# EAGLE design ATtiny_4585_dev_board_with_power_reg_and_resonator (EAGLE 6.2)
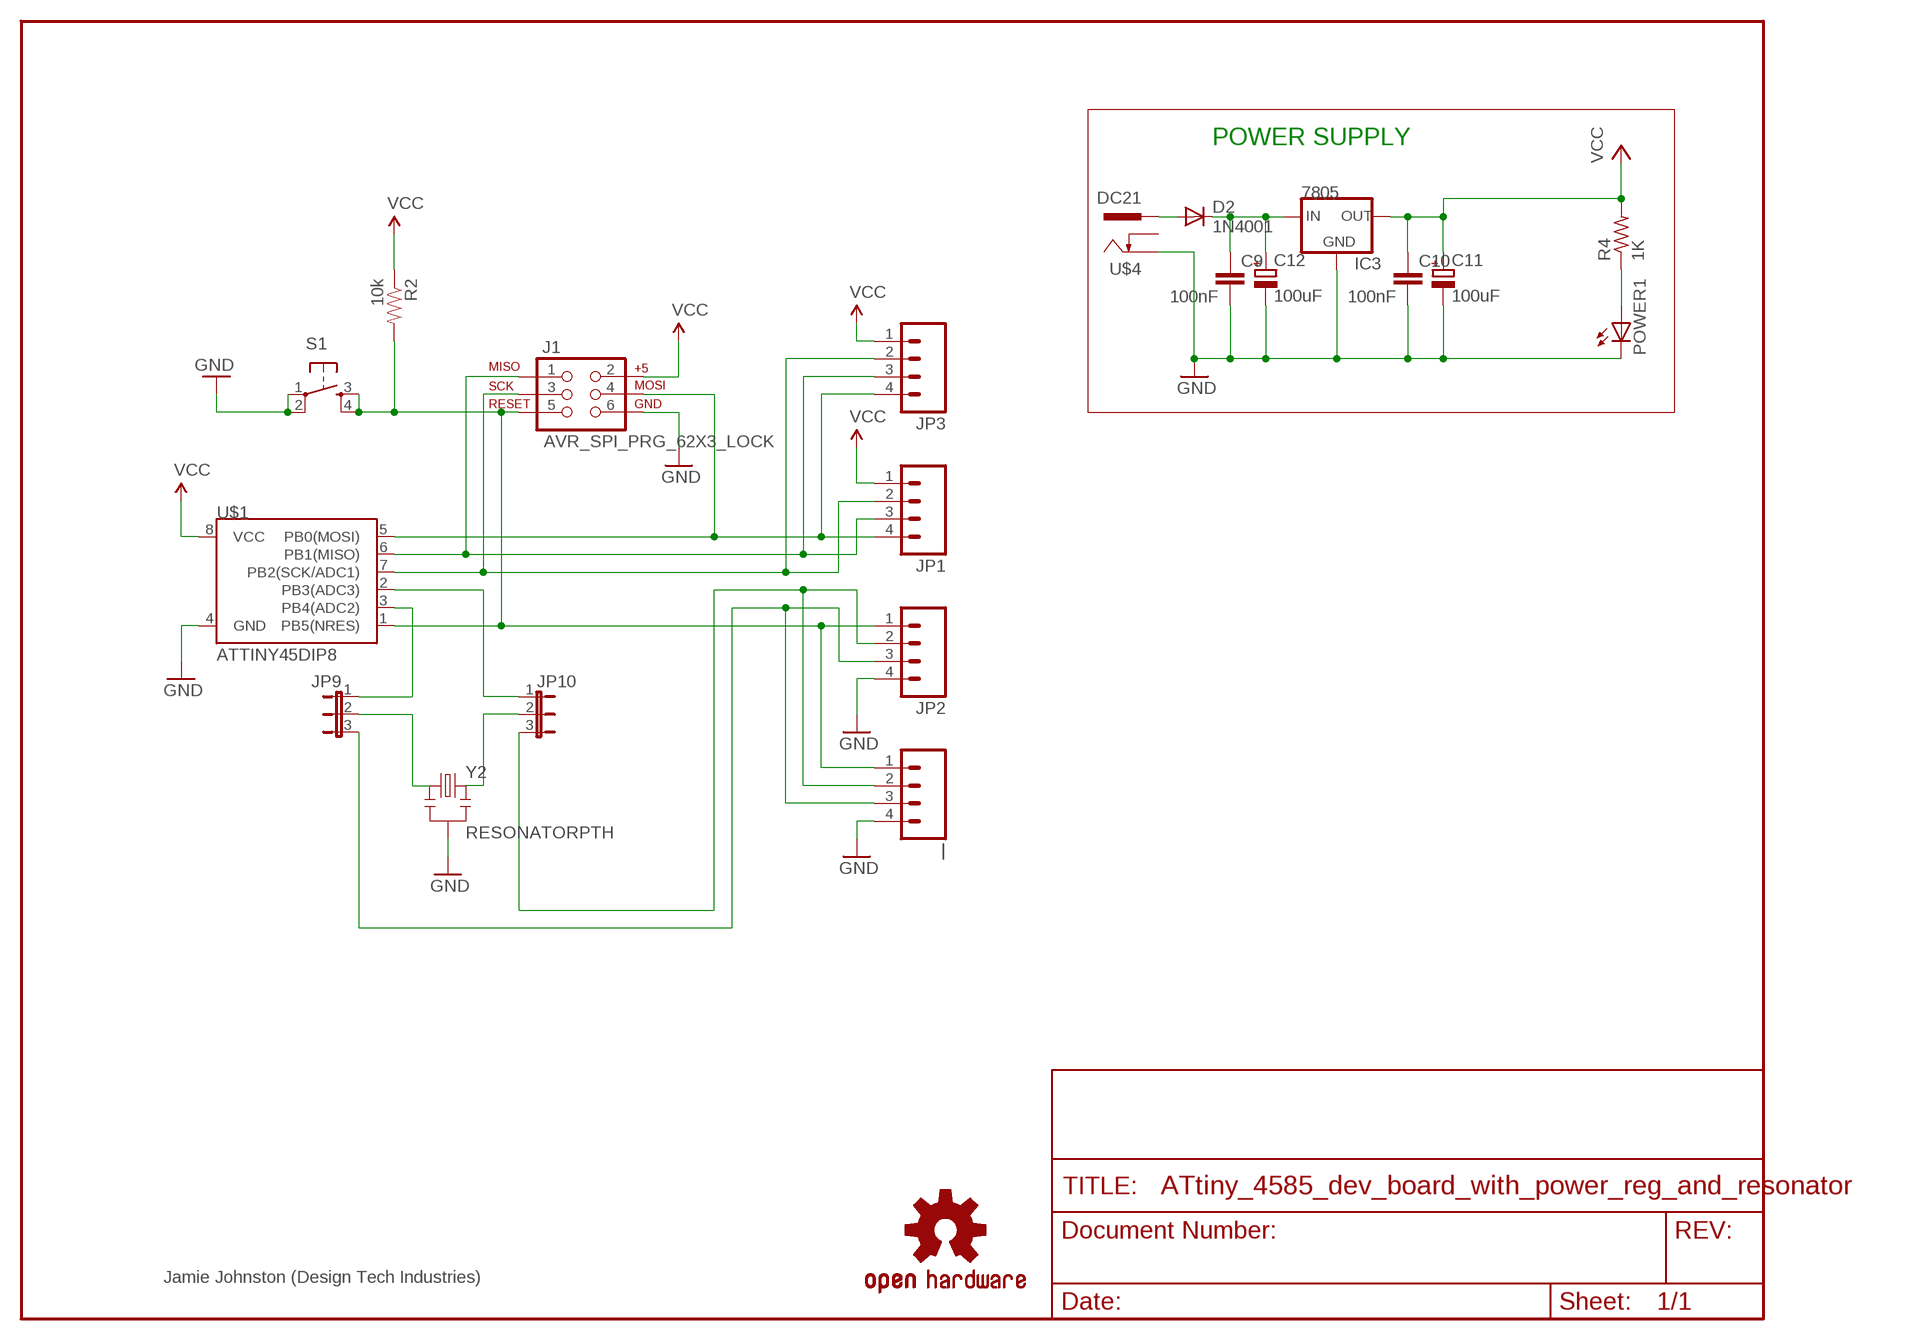
[diagram p0: schematic, sheet 1]

## Parts
C9  100nF  C-EU050-030X075  [C050-030X075]
C10  100nF  C-EU050-030X075  [C050-030X075]
C11  100uF  CPOL-EUE2.5-6  [E2,5-6]
C12  100uF  CPOL-EUE2.5-6  [E2,5-6]
D2  1N4001  1N4004  [DO41-10]
IC3  7805  V_REG_78XXSINK  [TO220-IGO]
J1  AVR_SPI_PRG_62X3_LOCK  [2X3_LOCK]
JP1  M04LOCK  [1X04_LOCK]
JP2  M04LOCK  [1X04_LOCK]
JP3  M04LOCK  [1X04_LOCK]
JP9  JP2E  [JP2]
JP10  JP2E  [JP2]
POWER1  LED3MM  [LED3MM]
R2  10k  RESISTORPTH-1/4W  [AXIAL-0.4]
R4  1K  R-US_0207/2V  [0207/2V]
S1  TAC_SWITCHPTH  [TACTILE-PTH]
U$1  ATTINY45DIP8  [DIP08]
U$3  OSHW-LOGOM  [OSHW-LOGO-M]
U$4  DC21  [DCSKT]
Y2  RESONATORPTH  [RESONATOR-PTH]
|  M04LOCK  [1X04_LOCK]

## Nets
GND: C9.2 C10.2 C11.- C12.- IC3.GND J1.6 JP2.4 POWER1.K(C) S1.1 S1.2 U$1.4(GND) U$4.2 Y2.2 |.4
N$1: JP9.1 U$1.3(PB4(ADC2))
N$2: J1.4 JP1.4 JP3.4 U$1.5(PB0(MOSI))
N$3: J1.5 JP2.1 R2.P$2 S1.3 S1.4 U$1.1(PB5(NRES)) |.1
N$4: JP10.1 U$1.2(PB3(ADC3))
N$6: J1.1 JP1.3 JP3.3 U$1.6(PB1(MISO))
N$7: J1.3 JP1.2 JP3.2 U$1.7(PB2(SCK/ADC1))
N$9: JP2.2 JP10.3 |.2
N$10: JP2.3 JP9.3 |.3
N$14: POWER1.A R4.1
N$20: JP9.2 Y2.1
N$21: JP10.2 Y2.3
VCC: C10.1 C11.+ IC3.OUT J1.2 JP1.1 JP3.1 R2.P$1 R4.2 U$1.8(VCC)
VIN [power]: D2.A U$4.1
VIN_SAFE [power]: C9.1 C12.+ D2.C IC3.IN
Unconnected: U$4.3

## Notes on the sheet
- POWER SUPPLY
- Jamie Johnston (Design Tech Industries)

## Library data of the parts
C9 C10 = rcl:C-EU: CAPACITOR, European symbol
C11 C12 = rcl:CPOL-EU: POLARIZED CAPACITOR, European symbol
D2 = diode:1N4004: DIODE general purpose rectifier, 1 A
IC3 = SparkFun:V_REG_78XX: Voltage Regulator Standard 7805 5V regulator. IGO (Input Ground Output). Spark Fun Electronics SKU : COM-00107
J1 = SparkFun:AVR_SPI_PRG_6: AVR ISP 6 Pin This is the reduced ISP connector for AVR programming. Common on Arduino. This footprint will take up less PCB space and can be used with a 10-pin to 6-pin adapter such as SKU: BOB-08508
JP1-JP3 | = SparkFun:M04: Header 4 Standard 4-pin 0.1" header. Use with straight break away headers (SKU : PRT-00116), right angle break away headers (PRT-00553), swiss pins (PRT-00743), machine pins (PRT-00117), and female headers (PRT-00115). Molex polarized connector foot print use with SKU : PRT-08231 with associated crimp pins and housings. 1MM SMD Version SKU: PRT-10208
JP9 JP10 = jumper:JP2E: JUMPER
POWER1 = led:LED: LED OSRAM: - CHIPLED LG R971, LG N971, LY N971, LG Q971, LY Q971, LO R971, LY R971 LH N974, LH R974 LS Q976, LO Q976, LY Q976 LO Q996 - Hyper CHIPLED LW Q18S LB Q993, LB Q99A, LB R99A - SideLED LS A670, LO A670, LY A670, LG A670, LP A670 LB A673, LV A673, LT A673, LW A673 LH A674 LY A675 LS A676, LA A676, LO A676, LY A676, LW A676 LS A679, LY A679, LG A679 - Hyper Micro SIDELED® LS Y876, LA Y876, LO Y876, LY Y876 LT Y87S - SmartLED LW L88C, LW L88S LB L89C, LB L89S, LG L890 LS L89K, LO L89K, LY L89K LS L896, LA L896, LO L896, LY L896 - TOPLED LS T670, LO T670, LY T670, LG T670, LP T670 LSG T670, LSP T670, LSY T670, LOP T670, LYG T670 LG T671, LOG T671, LSG T671 LB T673, LV T673, LT T673, LW T673 LH T674 LS T676, LA T676, LO T676, LY T676, LB T676, LH T676, LSB T676, LW T676 LB T67C, LV T67C, LT T67C, LS T67K, LO T67K, LY T67K, LW E67C LS E67B, LA E67B, LO E67B, LY E67B, LB E67C, LV E67C, LT E67C LW T67C LS T679, LY T679, LG T679 LS T770, LO T770, LY T770, LG T770, LP T770 LB T773, LV T773, LT T773, LW T773 LH T774 LS E675, LA E675, LY E675, LS T675 LS T776, LA T776, LO T776, LY T776, LB T776 LHGB T686 LT T68C, LB T68C - Hyper Mini TOPLED® LB M676 - Mini TOPLED Santana® LG M470 LS M47K, LO M47K, LY M47K Source: http://www.osram.convergy.de - LUMILED® LXK2-PW12-R00, LXK2-PW12-S00, LXK2-PW14-U00, LXK2-PW14-V00 LXK2-PM12-R00, LXK2-PM12-S00, LXK2-PM14-U00 LXK2-PE12-Q00, LXK2-PE12-R00, LXK2-PE12-S00, LXK2-PE14-T00, LXK2-PE14-U00 LXK2-PB12-K00, LXK2-PB12-L00, LXK2-PB12-M00, LXK2-PB14-N00, LXK2-PB14-P00, LXK2-PB14-Q00 LXK2-PR12-L00, LXK2-PR12-M00, LXK2-PR14-Q00, LXK2-PR14-R00 LXK2-PD12-Q00, LXK2-PD12-R00, LXK2-PD12-S00 LXK2-PH12-R00, LXK2-PH12-S00 LXK2-PL12-P00, LXK2-PL12-Q00, LXK2-PL12-R00 Source: www.luxeon.com
R2 = SparkFun:RESISTOR: Resistor Basic schematic elements and footprints for 0603, 1206, and PTH resistors.
R4 = rcl:R-US_: RESISTOR, American symbol
S1 = SparkFun:TAC_SWITCH: Momentary Switch Button commonly used for reset or general input. Spark Fun Electronics SKU : COM-00097
U$1 = SparkFun:ATTINY45: Atmel ATTiny45
U$3 = SparkFun-Aesthetics:OSHW-LOGO: Open Source Hardware Logo This logo indicates the piece of hardware it is found on incorporates a OSHW license and/or adheres to the definition of open source hardware found here: http://freedomdefined.org/OSHW
U$4 = dcsocket:DC21: DC 2.1 mm Power Socket Negative Centre
Y2 = SparkFun-FreqCtrl:RESONATOR: Resonator Small SMD resonator. This is the itty bitty 10/20MHz resonators with built in caps. CSTCE10M0G55 and CSTCE20M0V53. Footprint has been reviewed closely but hasn't been tested yet.

## Net classes
1 power: width 0.635 mm, clearance 0.406 mm

## Board
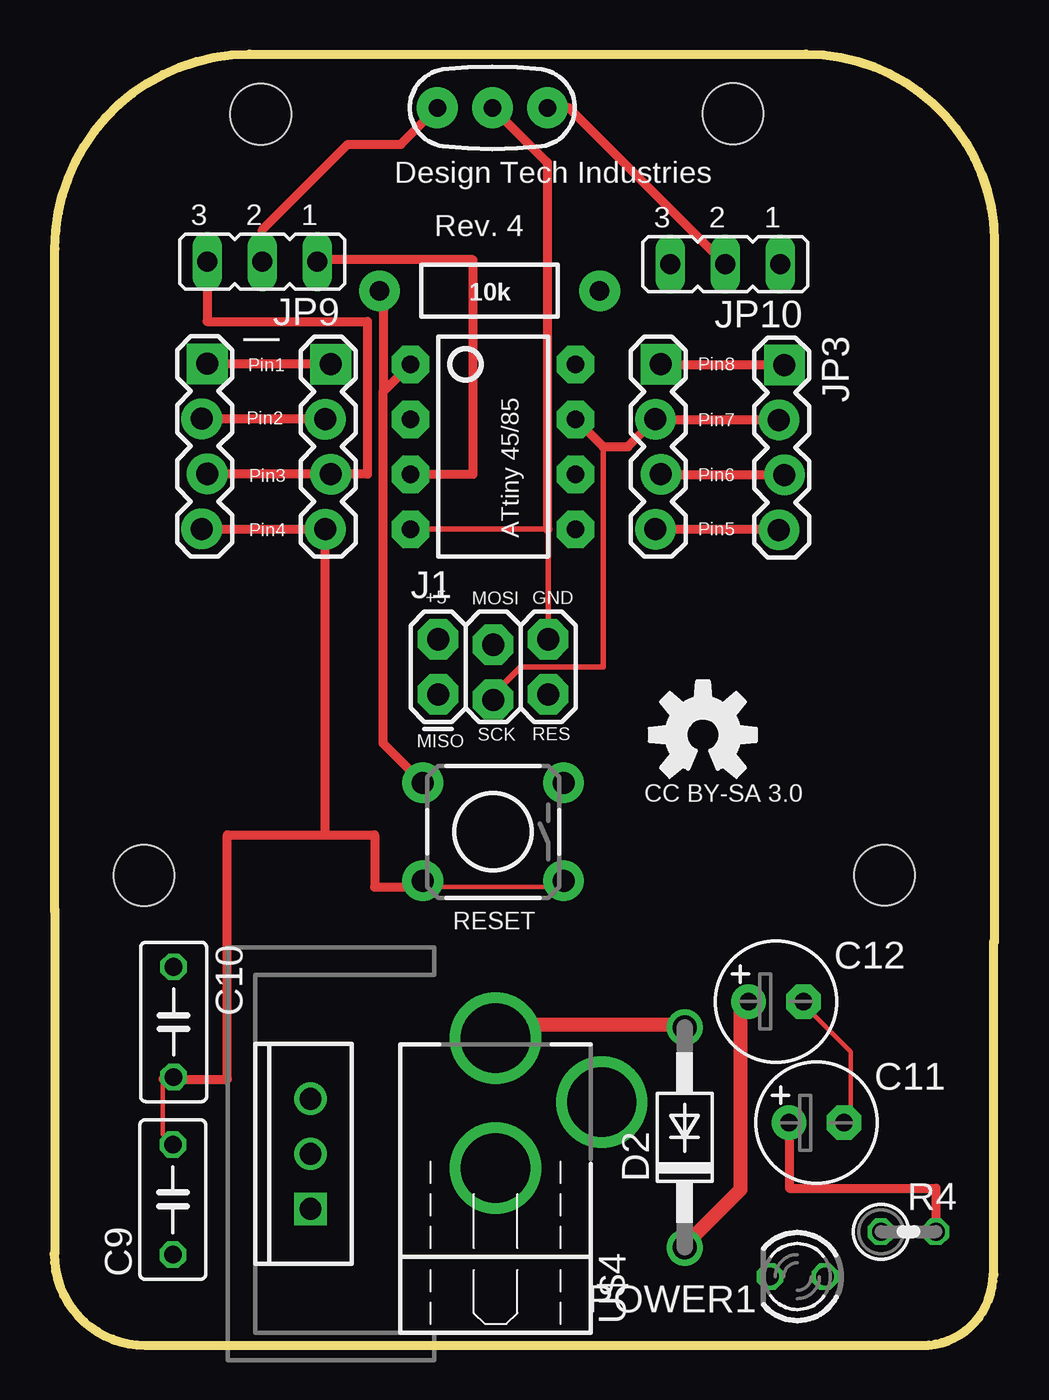
[diagram p1: board, top side]
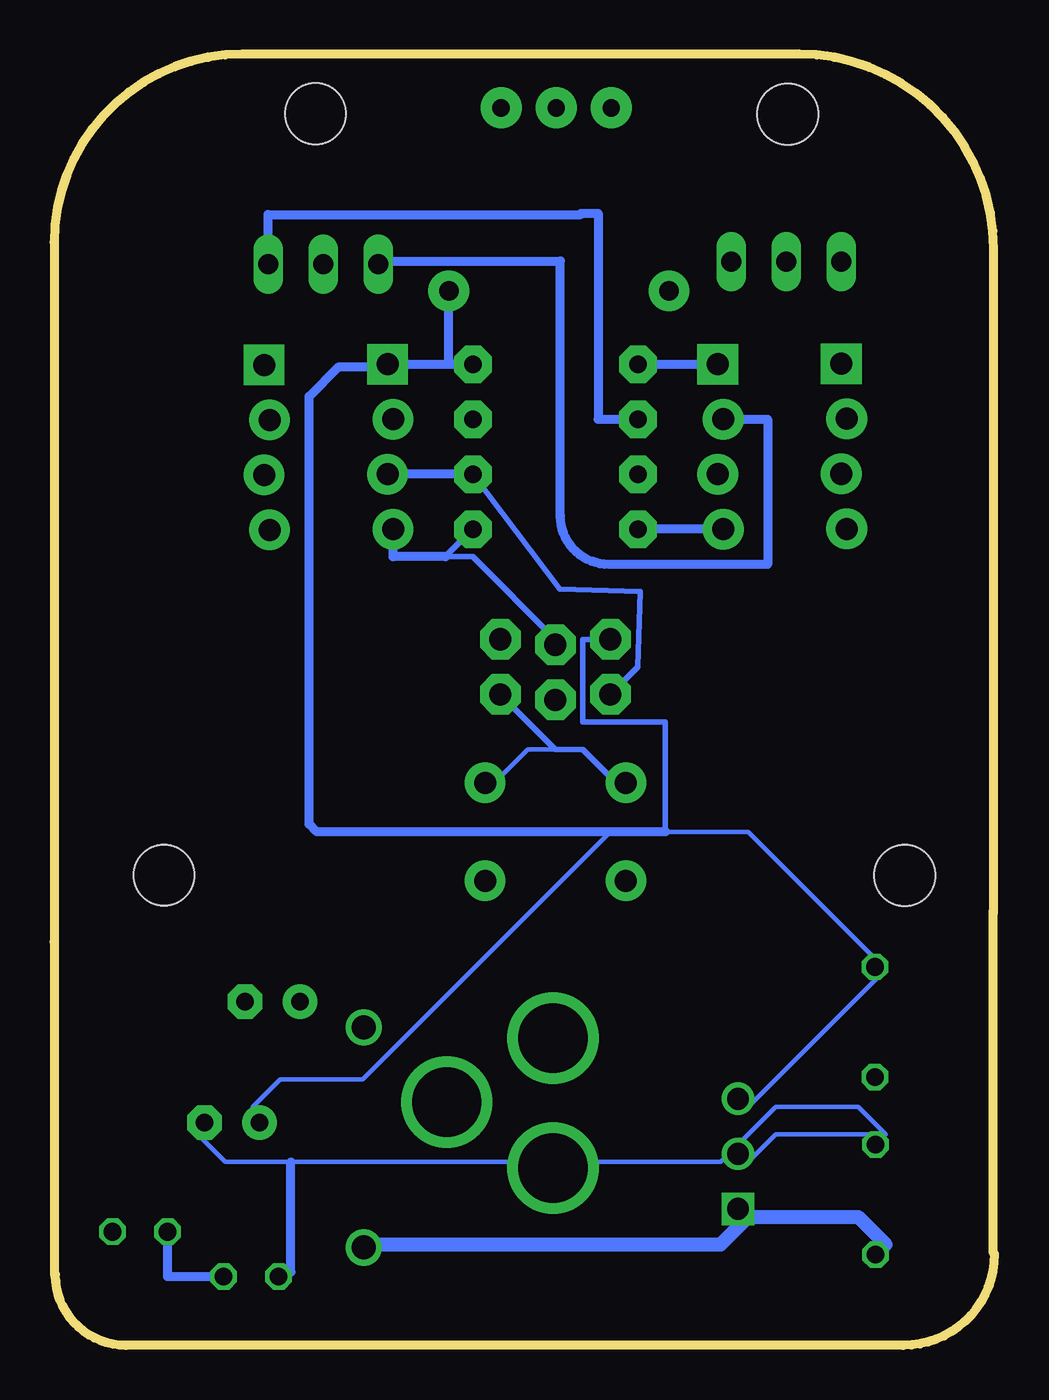
[diagram p2: board, bottom side, seen from below]

Size 43.4 x 59.62 mm. Coordinates in mm from the lower left corner, seen from the top.
Outline: 0,4.21 arc90 4.21,0 40.08,0 arc90 43.34,3.26
Outline: 0.05,4.25 0.05,20.11
Outline: 43.38,3.26 43.38,18.68
Outline: 0.04,19.99 0.04,50.64 arc-90 9.02,59.62 34.7,59.62 arc-90 43.4,50.92 43.4,18.63
Copper layers (1*16): Top 0.0356mm / dielectric 1.5011mm / Bottom 0.0356mm
Design rules: minimum track width 6mil, minimum drill 13mil, track to track 6mil, track to pad 6mil, pad to pad 6mil, via to via 6mil, smd to smd 6mil, copper to edge 15mil, drill to drill 6mil, minimum pad ring 7mil, minimum via ring 7mil, stop-mask expansion 4mil, vias tented up to drill 0mil, thermal gap 10mil
Holes 2.8 mm at 4.14,21.7 38.33,21.71 9.54,56.85 31.34,56.87

### Footprints (pad centres in the part's own frame; a part is rotated, then mirrored left to right if it is on the bottom)
C050-030X075 = drill 0.813 octagon: 1 -2.54,0; 2 2.54,0
E2,5-6 = drill 0.813 pad 1.6: + -1.27,0 | drill 0.813 pad 1.6 octagon: - 1.27,0
DO41-10 = drill 1.118: A 5.08,0; C -5.08,0
TO220-IGO = drill 1: GND 0,0; OUT 2.54,0 | drill 1 square: IN -2.54,0
2X3_LOCK = drill 1.016 pad 1.88 octagon: 1 0,0; 2 0,2.54; 3 2.54,-0.254; 4 2.54,2.286; 5 5.08,0; 6 5.08,2.54
1X04_LOCK = drill 1.016 pad 1.88 square: 1 0,0.127 | drill 1.016 pad 1.88: 2 2.54,-0.127; 3 5.08,0.127; 4 7.62,-0.127
JP2 = drill 0.914 long: 1 -2.54,0; 2 0,0; 3 2.54,0
LED3MM = drill 0.813 octagon: A -1.27,0; K 1.27,0
AXIAL-0.4 = drill 0.9 pad 1.88: P$1 -5.08,0; P$2 5.08,0
0207/2V = drill 0.813 octagon: 1 -1.27,0; 2 1.27,0
TACTILE-PTH = drill 1.016 pad 1.88: 1 -3.251,2.261; 2 3.251,2.261; 3 -3.251,-2.261; 4 3.251,-2.261
DIP08 = drill 0.813 pad 1.727 octagon: 1 -3.81,-3.81; 2 -1.27,-3.81; 3 1.27,-3.81; 4 3.81,-3.81; 5 3.81,3.81; 6 1.27,3.81; 7 -1.27,3.81; 8 -3.81,3.81
DCSKT = drill 3.2: 1 0,6.08; 2 0,0.08; 3 4.9,3.13
RESONATOR-PTH = drill 0.8 pad 1.88: 1 -2.54,0; 2 0,0; 3 2.54,0

### Placement (x,y rotation side)
C9  5.48,6.73 90 top
C10  5.51,14.93 270 top
C11  35.18,10.28 0 top
C12  33.32,15.88 0 top
D2  29.11,9.6 90 top
IC3  11.83,8.84 90 top
J1  17.72,30.06 0 top
JP1  27.88,45.3 270 top
JP2  12.64,45.3 270 top
JP3  33.58,45.27 270 top
JP9  9.61,50.04 180 top
JP10  30.98,49.93 180 top
POWER1  34.31,3.18 180 top
R2  20.1,48.7 180 top
R4  39.43,5.25 0 top
S1  20.26,23.71 180 top
U$1  20.26,41.49 270 top
U$3  29.95,28.19 0 top
U$4  20.38,8.11 0 top
Y2  20.23,57.15 0 top
|  6.94,45.32 270 top

### Tracks (layer width: path | path; a pad name or v marks a point on that pad's centre or on a via)
GND
  Top 0.203: S1.1 22.8,21.17 17.72,21.17 17.46,21.28 S1.2 16.45,21.17 | C9.2 5.02,9.74 5.02,12.28 C10.2 | C12.- 34.23,16.09 36.77,13.55 36.77,11.01 C11.-
  Top 0.254: J1.6 22.8,37.68 U$1.4
  Top 0.406: 5.02,12.28 7.99,12.28 7.99,23.57 12.51,23.57 | 12.51,23.57 JP2.4 12.51,37.7 |.4 | 12.51,23.57 14.79,23.57 14.79,21.17 17.46,21.17 17.46,21.28 | 22.8,37.68 22.78,37.68 22.78,54.61 22.76,54.61 Y2.2
  Bottom 0.203: C11.- 36.77,9.74 35.5,8.47 32.48,8.47 21.53,8.47 U$4.2 20.26,8.47 12.64,8.47 10.1,11.01 6.29,11.01 5.02,9.74 | 5.02,9.74 10.1,9.74 11.37,8.47 IC3.GND | 32.96,3.39 POWER1.K | 5.02,9.74 C9.2
  Bottom 0.406: JP2.4 U$1.4 | 32.96,3.39 32.48,3.39 32.48,8.47
N$1
  Top 0.406: U$1.3 19.34,40.22 19.34,50.12 12.15,50.12 JP9.1
N$2
  Top 0.406: JP1.4 33.46,37.68 JP3.4
  Bottom 0.254: U$1.5 25.34,36.41 24.07,36.41 20.26,32.6 J1.4
  Bottom 0.406: 25.34,36.41 27.75,36.41 JP1.4
N$3
  Top 0.406: 15.18,44.03 U$1.1 | 15.18,44.03 15.18,42.74 15.18,27.8 S1.4 | |.1 12.77,45.32 JP2.1 | R2.P$2 15.18,48.7 15.18,44.03
  Bottom 0.203: 20.26,27.52 21.53,27.52 22.8,26.25 S1.3
  Bottom 0.254: J1.5 20.26,27.52 18.99,27.52 17.72,26.25 S1.4
  Bottom 0.406: U$1.1 JP2.1
N$4
  Bottom 0.406: JP10.1 33.52,52.22 19.09,52.22 19.09,52.27 18.29,52.27 18.29,42.76 U$1.2
N$6
  Top 0.406: JP3.3 28.01,40.19 JP1.3
  Bottom 0.254: J1.1 16.45,31.33 16.35,34.82 20.06,34.92 U$1.6
  Bottom 0.406: U$1.6 JP1.3
N$7
  Top 0.254: 25.34,41.49 25.34,31.33 21.53,31.33 20.26,30.06 J1.3
  Top 0.406: U$1.7 25.34,41.49 26.48,41.49 JP1.2 27.75,42.73 JP3.2
N$9
  Top 0.406: |.2 12.51,42.78 JP2.2
  Bottom 0.406: JP10.3 28.44,50.07 20.04,50.07 20.04,38.3 arc-90 17.8,36.06 10.47,36.06 10.47,42.76 JP2.2
N$10
  Top 0.406: |.3 12.77,40.24 JP2.3 14.46,40.22 14.46,47.28 7.07,47.28 JP9.3
N$14
  Bottom 0.406: POWER1.A 38.16,3.18 R4.1
N$20
  Top 0.406: JP9.2 9.61,51.51 13.56,55.46 16,55.46 Y2.1
N$21
  Top 0.406: JP10.2 23.76,57.15 Y2.3
VCC
  Top 0.406: C11.+ 33.94,10.28 33.94,7.25 40.7,7.25 R4.2 | JP3.1 28.01,45.27 JP1.1
  Bottom 0.203: 5.02,17.36 11.37,11.01 IC3.OUT | 5.02,17.36 11.37,23.71 15.18,23.71 | 5.02,17.36 C10.1 | 17.72,23.71 29.15,12.28 32.96,12.28 34.23,11.01 C11.+
  Bottom 0.254: J1.2 18.99,32.6 18.99,28.79 15.18,28.79 15.18,23.71
  Bottom 0.406: 15.18,23.71 17.72,23.71 31.27,23.71 31.63,24.07 31.63,43.82 30.25,45.19 28.12,45.19 JP1.1 U$1.8 25.18,45.3 R2.P$1
VIN
  Top 0.635: D2.A 29.15,14.82 21.53,14.82 U$4.1
  Bottom 0.635: 29.15,14.82 D2.A
VIN_SAFE
  Top 0.635: C12.+ 31.69,16.09 31.69,7.2 29.15,4.66 D2.C
  Bottom 0.635: 11.37,5.93 6.29,5.93 5.02,4.66 C9.1 | 11.37,5.93 12.64,4.66 29.15,4.66 D2.C | 11.37,5.93 IC3.IN

### Text on the board
tPlace: Design Tech Industries | Rev. 4 | Pin1 | Pin8 | Pin2 | Pin7 | Pin3 | Pin6 | Pin4 | Pin5 | ATtiny 45/85 | +5 | MOSI | GND | MISO | SCK | RES | CC BY-SA 3.0 | RESET